# Altium schematic sheet Depth Sensor for SPL1301 V1.0.SchDoc
size A4
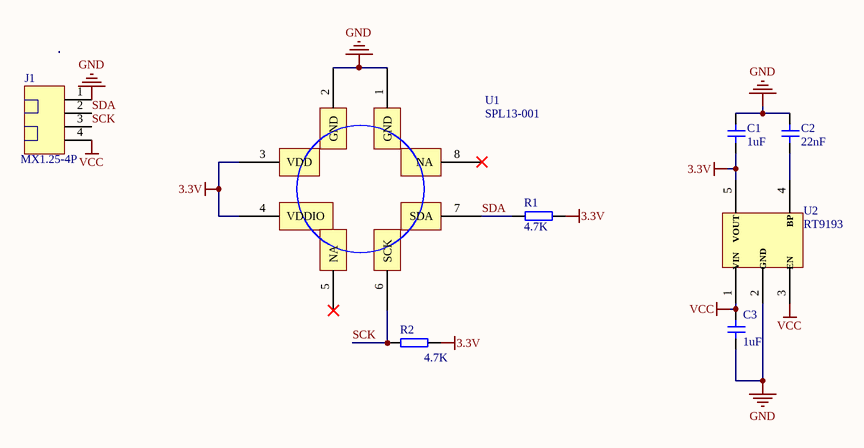
[diagram p0: Depth Sensor for SPL1301 V1.0.SchDoc]

## Parts
C1  1uF  [0603C]
C2  22nF  [0603C]
C3  1uF  [0603C]
J1  MX1.25-4P  [MX1.25-4P]
R1  4.7K  [0603R]
R2  4.7K  [0603R]
U1  SPL13-001  [SPL13-001]
U2  RT9193  [RT9193]

## Nets
3.3V: C1.1 R1.1 R2.1 U1.3(VDD) U1.4(VDDIO) U2.5(VOUT)
GND: C1.2 C2.2 C3.1 J1.1 U1.1(GND) U1.2(GND) U2.2(GND)
VCC: C3.2 J1.4 U2.1(VIN) U2.3(EN)
SCK: J1.3 R2.2 U1.6(SCK)
SDA: J1.2 R1.2 U1.7(SDA)
NetC2_1: C2.1 U2.4(BP)

Not connected (* = marked no-connect by the designer): U1 5(NA)* 8(NA)*

## Library data of the parts
C1-C3 = Cap1: 无极贴片电容
J1 = MX1.25-4P_1
R1 R2 = Res: 电阻
U1 = SPL13-001_1